# EAGLE design remote_sch (EAGLE 9.6.2)
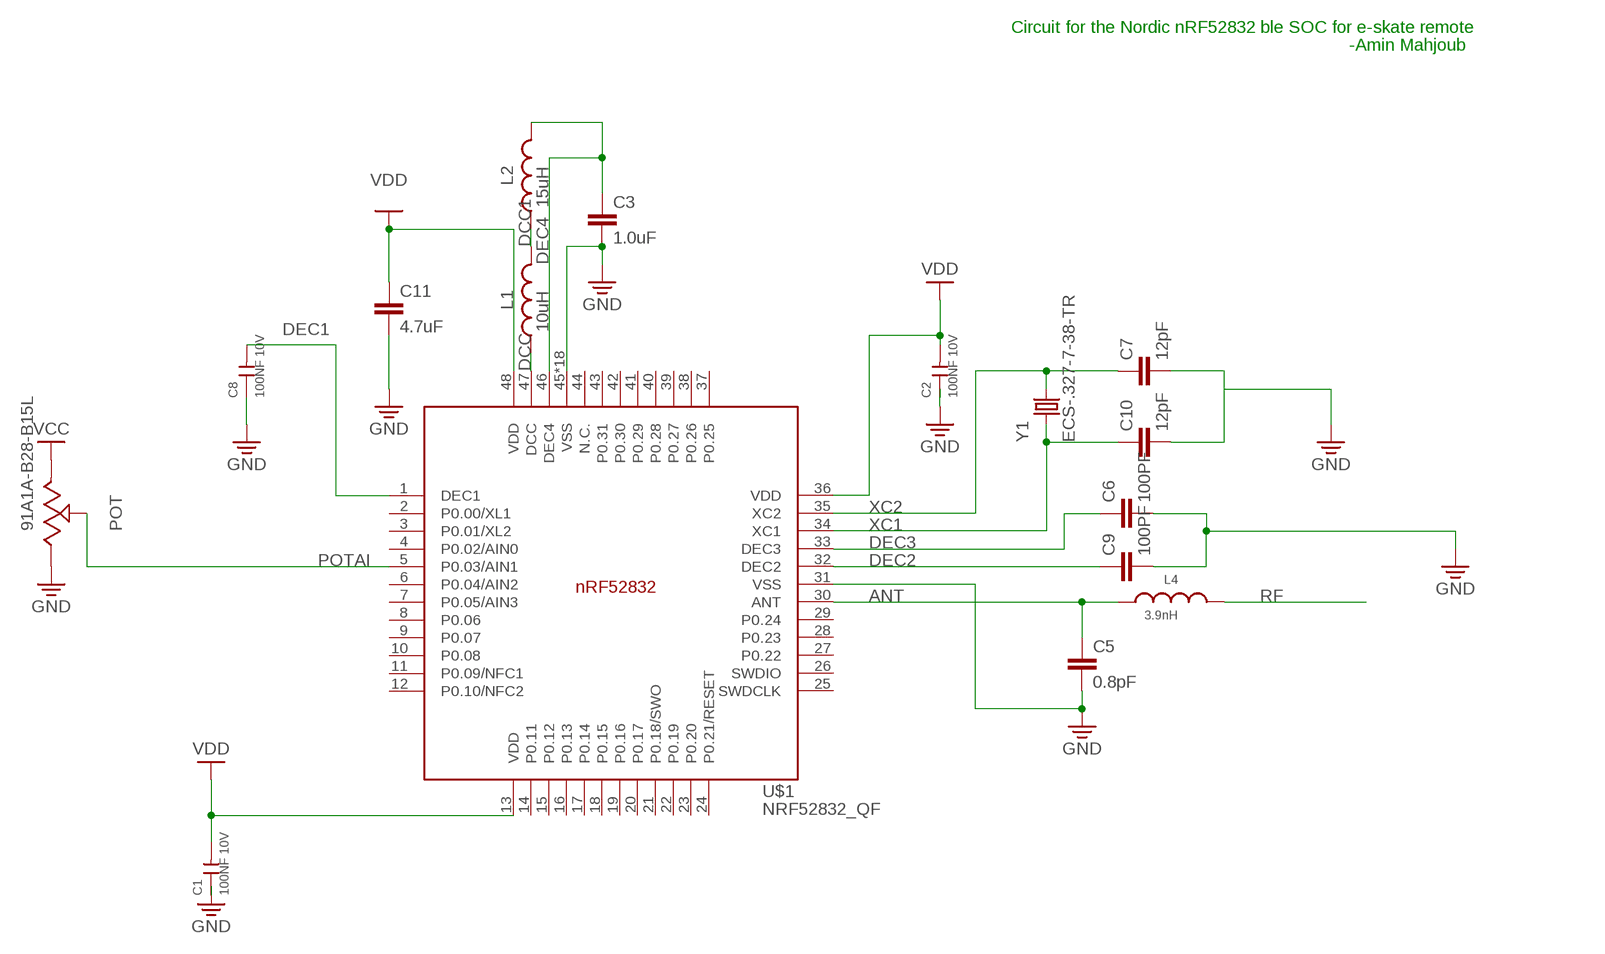
[diagram p0: schematic, sheet 1]

## Parts
C1  100NF 10V  CERAMIC 100NF-10V-10%-X5R(0402)  [C0402]
C2  100NF 10V  CERAMIC 100NF-10V-10%-X5R(0402)  [C0402]
C3  1.0uF  1.0UF-0402-16V-10%  [0402]
C5  0.8pF  0.8PF-0402-50V-0.1PF  [0402]
C6  100PF  100PF-0402-50V-5%  [0402]
C7  12pF  12PF-0603-50V-5%  [0603]
C8  100NF 10V  CERAMIC 100NF-10V-10%-X5R(0402)  [C0402]
C9  100PF  100PF-0402-50V-5%  [0402]
C10  12pF  12PF-0603-50V-5%  [0603]
C11  4.7uF  4.7UF-0402_TIGHT-6.3V-20%-X5R  [0402-TIGHT]
L1  10uH  WE-MAIA_2510_78438323100  [WE-MAIA_2510]
L2  15uH  WE-MAIA_3015_78438335150  [WE-MAIA_3015]
L4  3.9nH  WE-MK_0201_7447820039  [WE-MK_0201]
POT  91A1A-B28-B15L  [91A1A-B28-B15L-ND]
U$1  NRF52832_QF  [QFN40P600X600X90-48_N]
Y1  ECS-.327-7-38-TR  [ECS-.327-7-38-TR]

## Nets
ANT: C5.1 L4.1 U$1.30(ANT)
DCC: L1.1 U$1.47(DCC)
DCC1: L1.2 L2.1
DEC1: C8.2 U$1.1(DEC1)
DEC2: C9.1 U$1.32(DEC2)
DEC3: C6.1 U$1.33(DEC3)
DEC4: C3.1 L2.2 U$1.46(DEC4)
GND: C1.1 C2.1 C3.2 C5.2 C6.2 C7.2 C8.1 C9.2 C10.2 C11.2 POT.3 U$1.31(VSS) U$1.45(VSS) U$1.PAD(VSS) U$1.PAD@VIA01(VSS) U$1.PAD@VIA02(VSS) U$1.PAD@VIA03(VSS) U$1.PAD@VIA04(VSS) U$1.PAD@VIA05(VSS) U$1.PAD@VIA06(VSS) U$1.PAD@VIA07(VSS) U$1.PAD@VIA08(VSS) U$1.PAD@VIA09(VSS) U$1.PAD@VIA10(VSS) U$1.PAD@VIA11(VSS) U$1.PAD@VIA12(VSS) U$1.PAD@VIA13(VSS) U$1.PAD@VIA14(VSS) U$1.PAD@VIA15(VSS) U$1.PAD@VIA16(VSS)
POTAI: POT.2 U$1.5(P0.03/AIN1)
RF: L4.2
VCC: POT.1
VDD: C1.2 C2.2 C11.1 U$1.13(VDD) U$1.36(VDD) U$1.48(VDD)
XC1: C10.1 U$1.34(XC1) Y1.1
XC2: C7.1 U$1.35(XC2) Y1.4
Unconnected: U$1.2(P0.00/XL1) U$1.3(P0.01/XL2) U$1.4(P0.02/AIN0) U$1.6(P0.04/AIN2) U$1.7(P0.05/AIN3) U$1.8(P0.06) U$1.9(P0.07) U$1.10(P0.08) U$1.11(P0.09/NFC1) U$1.12(P0.10/NFC2) U$1.14(P0.11) U$1.15(P0.12) U$1.16(P0.13) U$1.17(P0.14) U$1.18(P0.15) U$1.19(P0.16) U$1.20(P0.17) U$1.21(P0.18/SWO) U$1.22(P0.19) U$1.23(P0.20) U$1.24(P0.21/RESET) U$1.25(SWDCLK) U$1.26(SWDIO) U$1.27(P0.22) U$1.28(P0.23) U$1.29(P0.24) U$1.37(P0.25) U$1.38(P0.26) U$1.39(P0.27) U$1.40(P0.28) U$1.41(P0.29) U$1.42(P0.30) U$1.43(P0.31) U$1.44(N.C.)

## Notes on the sheet
- Circuit for the Nordic nRF52832 ble SOC for e-skate remote
- -Amin Mahjoub

## Library data of the parts
C1 C2 C8 = OPL_Capacitor:CERAMIC 100NF-10V-10%-X5R(0402): 302010037; MPN: CC0402KRX5R6BB104
C3 = SparkFun-Capacitors:1.0UF: 1µF ceramic capacitors A capacitor is a passive two-terminal electrical component used to store electrical energy temporarily in an electric field.; PROD_ID: CAP-12417
C5 = SparkFun-Capacitors:0.8PF: 0.8pF ceramic capacitors A capacitor is a passive two-terminal electrical component used to store electrical energy temporarily in an electric field.; PROD_ID: CAP-13456
C6 C9 = SparkFun-Capacitors:100PF: 100pF/0.1nF ceramic capacitors A capacitor is a passive two-terminal electrical component used to store electrical energy temporarily in an electric field.; PROD_ID: CAP-13458
C7 C10 = SparkFun-Capacitors:12PF: 12pF ceramic capacitors A capacitor is a passive two-terminal electrical component used to store electrical energy temporarily in an electric field.; PROD_ID: CAP-09137
C11 = SparkFun-Capacitors:4.7UF: 4.7µF ceramic capacitors A capacitor is a passive two-terminal electrical component used to store electrical energy temporarily in an electric field.; PROD_ID: CAP-14240
L1 = Wurth_Automotive_WE-MAIA:WE-MAIA_2510: WE-MAIA SMD Power Inductor Characteristics Magnetic iron alloy allows high rated currents Compact design Magnetically shielded Hight current capability and handles hight transient current spikes No acoustic noise and no leakage flux noise Operating temperature range: -40°C up to +125°C Applications Power supplies for mobile devices DC/DC-converter for high current power supplies DC/DC-converter for Field Programmable Gate Array (FPGA) POL-converters Microcontroller Portable as well as battery-driven devices Wireless communication devices <https://katalog.we-online.de/media/images/v2/o56285v209%20Family_WE-MAIA.jpg> Details see: https://katalog.we-online.de/en/am/WE-MAIA Updated By Ella Wu 2019-09-10 2019 (C) Wurth Elektronik; DATASHEET-URL: https://katalog.we-online.de/am/datasheet/78438323100.pdf; FRES: 25MHz; IR: 0.6A; ISAT: 1.35A; MOUNT: SMT; PART-NUMBER: 78438323100; RDC: 843mOhm
L2 = Wurth_Automotive_WE-MAIA:WE-MAIA_3015: WE-MAIA SMD Power Inductor Characteristics Magnetic iron alloy allows high rated currents Compact design Magnetically shielded Hight current capability and handles hight transient current spikes No acoustic noise and no leakage flux noise Operating temperature range: -40°C up to +125°C Applications Power supplies for mobile devices DC/DC-converter for high current power supplies DC/DC-converter for Field Programmable Gate Array (FPGA) POL-converters Microcontroller Portable as well as battery-driven devices Wireless communication devices <https://katalog.we-online.de/media/images/v2/o56285v209%20Family_WE-MAIA.jpg> Details see: https://katalog.we-online.de/en/am/WE-MAIA Updated By Ella Wu 2019-09-10 2019 (C) Wurth Elektronik; DATASHEET-URL: https://katalog.we-online.de/am/datasheet/78438335150.pdf; FRES: 14MHz; IR: 0.65A; ISAT: 1.71A; MOUNT: SMT; PART-NUMBER: 78438335150; RDC: 830mOhm
L4 = Wurth_Signal & Communications_WE-MK:WE-MK_0201: WE-MK Multilayer Ceramic SMT Inductor Characteristics Windings printed on ceramic substrate Extremely high self resonant frequency > 17 GHz Inductive tolerances of 5%; ± 0.3 nH Operating temperature: –40°C to +120°C Inductance is stable over temperature Recommended solder profile: Reflow/wave Applications High frequency circuits Bluetooth Wireless LAN Filter circuits Oscillators Pagers Laptops PCMCIA-cards <https://www.we-online.com/catalog/media/o175867v209%20Gruppe_WE-MK_0402A_0201_0603.jpg> Details see: https://www.we-online.com/catalog/en/WE-MK/ Updated by Ella Wu 2020-10-29 2020 (C) Wurth Elektronik; DATASHEET-URL: https://www.we-online.de/katalog/datasheet/7447820039.pdf; FRES: 6000MHz; IR: 300mA; MOUNT: SMT; PART-NUMBER: 7447820039; Q-FACTOR: 4; RDC: 0.27Ohm
POT = Potentiometer_Trimmers:91A1A-B28-B15L: POT 10K OHM 1W PLASTIC LINEAR Manufacturer's datasheet <https://www.bourns.com/docs/Product-Datasheets/91_95.pdf>; CREATED_BY: PCBLayout.com; DIGIKEY_PARTNO: 91A1A-B28-B15L-ND; MANUFACTURER: Bourns Inc.; MPN: 91A1A-B28-B15L
U$1 = Nordic_nRF:NRF52832_QF: nRF52832 Features Single chip, highly flexible, 2.4 GHz multi-protocol SoC 32-bit ARM Cortex-M4F Processor 1.7v to 3.6v operation 512kB flash + 64kB RAM Supports concurrent Bluetooth Smart/ANT protocol operation On-chip NFC tag for Out-of-Band (OOB) pairing Up to +4dBm output power -96dBm sensitivity, Bluetooth Smart Thread safe and run-time protected Event driven API On air compatible with nRF24L and nRF24AP series 2 data rates (2Mbps/1Mbps) PPI - maximum flexibility for power-efficient applications and code simplification Automated power management system with automatic power management of each peripheral Configurable I/O mapping for analog and digital I/O 3 x Master/Slave SPI 2 x Two-wire interface (I²C) UART (RTS/CTS) 3 x PWM AES HW encryption Real Time Counter (RTC) Digital microphone interface (PDM) On-chip balun Applications Internet of Things (IoT) Wearables SmartHome sensors Connected white goods Computer peripherals Voice-command smart remotes A4WP ‘Rezence’ wireless charging Beacons Sports and fitness sensors and hubs Connected health products Smart watches RC Toys Interactive games Building automation and sensor networks
Y1 = Crystals_Oscillators:ECS-.327-7-38-TR: CRYSTAL 32.7680KHZ 7PF SMD Manufacturer's datasheet <https://ecsxtal.com/store/pdf/ecx-71.pdf>; CREATED_BY: PCBLayout.com; DIGIKEY_PART_NUMBER: XC1657TR-ND; MANUFACTURER: ECS Inc.; MPN: ECS-.327-7-38-TR; PACKAGE: 4-SMD

## Board
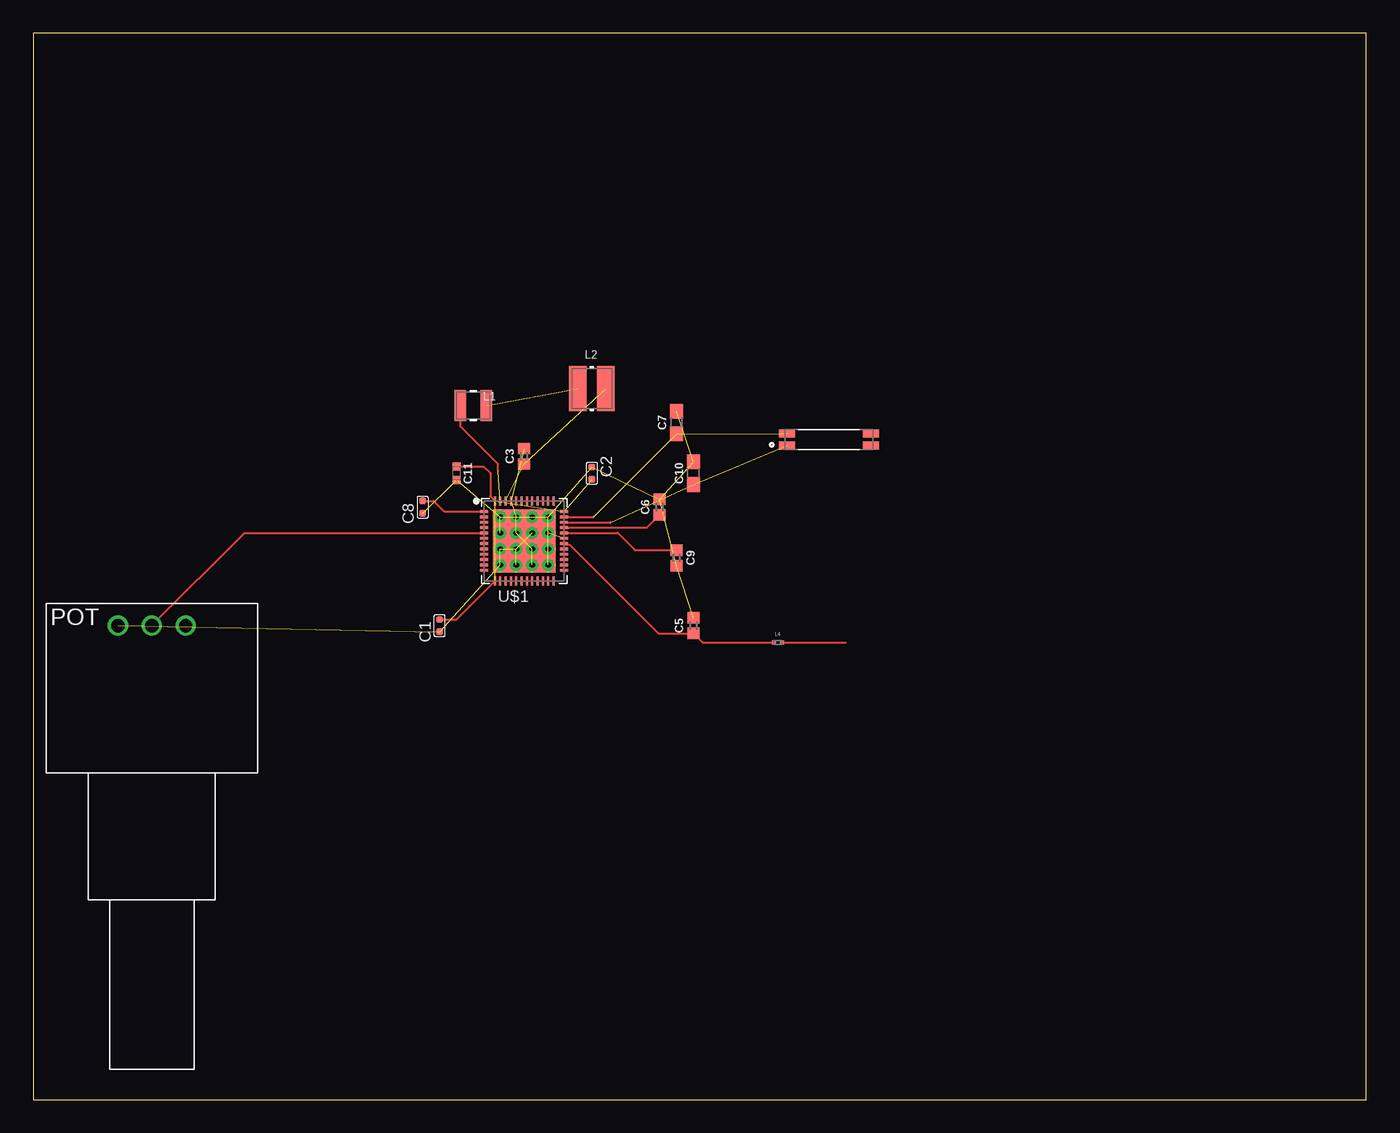
[diagram p1: board, top side]

Size 100 x 80 mm. Coordinates in mm from the lower left corner, seen from the top.
Outline: 0,0 100,0 100,80 0,80 0,0
Copper layers (1*16): Top 0.035mm / dielectric 1.5mm / Bottom 0.035mm
Design rules "default": minimum track width 6mil, minimum drill 0.35mm, track to track 6mil, track to pad 6mil, pad to pad 6mil, via to via 6mil, smd to smd 6mil, copper to edge 40mil, drill to drill 6mil, minimum pad ring 10mil, minimum via ring 8mil, stop-mask expansion 4mil, vias tented up to drill 0mil, thermal gap 10mil

### Footprints (pad centres in the part's own frame; a part is rotated, then mirrored left to right if it is on the bottom)
C0402 = smd 0.5 x 0.5: 1 0,0.463; 2 0,-0.463
0402 = smd 0.85 x 0.9: 1 -0.58,0; 2 0.58,0
0603 = smd 1.1 x 1: 1 -0.85,0; 2 0.85,0
0402-TIGHT = smd 0.6 x 0.6: 1 -0.5,0; 2 0.5,0
WE-MAIA_2510 = smd 0.85 x 2.3: 1 -0.975,0; 2 0.975,0
WE-MAIA_3015 = smd 1.3 x 3.4: 1 -1.05,0; 2 1.05,0
WE-MK_0201 = smd 0.3 x 0.3: 1 -0.3,0; 2 0.3,0
91A1A-B28-B15L-ND = drill 1: 1 2.54,0; 2 0,0; 3 -2.54,0
QFN40P600X600X90-48_N = smd 0.65 x 0.2: 1 -3,2.2; 2 -3,1.8; 3 -3,1.4; 4 -3,1; 5 -3,0.6; 6 -3,0.2; 7 -3,-0.2; 8 -3,-0.6; 9 -3,-1; 10 -3,-1.4; 11 -3,-1.8; 12 -3,-2.2; 25 3,-2.2; 26 3,-1.8; 27 3,-1.4; 28 3,-1; 29 3,-0.6; 30 3,-0.2; 31 3,0.2; 32 3,0.6; 33 3,1; 34 3,1.4; 35 3,1.8; 36 3,2.2 | smd 0.2 x 0.65: 13 -2.2,-3; 14 -1.8,-3; 15 -1.4,-3; 16 -1,-3; 17 -0.6,-3; 18 -0.2,-3; 19 0.2,-3; 20 0.6,-3; 21 1,-3; 22 1.4,-3; 23 1.8,-3; 24 2.2,-3; 37 2.2,3; 38 1.8,3; 39 1.4,3; 40 1,3; 41 0.6,3; 42 0.2,3; 43 -0.2,3; 44 -0.6,3; 45 -1,3; 46 -1.4,3; 47 -1.8,3; 48 -2.2,3 | smd 4.7 x 4.7: PAD 0,0 | drill 0.4: PAD@VIA01 -1.8,1.8; PAD@VIA02 -1.8,0.6; PAD@VIA03 -1.8,-0.6; PAD@VIA04 -1.8,-1.8; PAD@VIA05 -0.6,1.8; PAD@VIA06 -0.6,0.6; PAD@VIA07 -0.6,-0.6; PAD@VIA08 -0.6,-1.8; PAD@VIA09 0.6,1.8; PAD@VIA10 0.6,0.6; PAD@VIA11 0.6,-0.6; PAD@VIA12 0.6,-1.8; PAD@VIA13 1.8,1.8; PAD@VIA14 1.8,0.6; PAD@VIA15 1.8,-0.6; PAD@VIA16 1.8,-1.8
ECS-.327-7-38-TR = smd 1.2 x 0.6: 1 -3.15,-0.45; 2 3.15,-0.45; 3 3.15,0.45; 4 -3.15,0.45

### Placement (x,y rotation side)
C1  30.48,35.56 180 top
C2  41.91,46.99 0 top
C3  36.83,48.26 90 top
C5  49.53,35.56 90 top
C6  46.99,44.45 90 top
C7  48.26,50.8 90 top
C8  29.21,44.45 180 top
C9  48.26,40.64 270 top
C10  49.53,46.99 90 top
C11  31.75,46.99 270 top
L1  33.02,52.07 0 top
L2  41.91,53.34 0 top
L4  55.88,34.29 0 top
POT  8.89,35.56 0 top
U$1  36.83,41.91 0 top
Y1  59.69,49.53 0 top

### Tracks (layer width: path | path; a pad name or v marks a point on that pad's centre or on a via)
ANT
  Top 0.152: U$1.30 39.9,41.64 40.23,41.64 46.89,34.98 C5.1 50.22,34.29 L4.1
DCC  (1 unrouted)
  Top 0.152: L1.1 32.05,50.51 34.88,47.67 34.88,47.16
DCC1  (1 unrouted)
DEC1
  Top 0.152: C8.2 30.02,44.91 30.82,44.11 U$1.1
DEC2
  Top 0.152: U$1.32 43.85,42.51 45.14,41.22 C9.1
DEC3
  Top 0.152: U$1.33 46.03,42.91 C6.1
DEC4  (2 unrouted)
GND  (29 unrouted)
POTAI
  Top 0.152: POT.2 15.84,42.51 U$1.5
RF
  Top 0.152: L4.2 60.96,34.29
VDD  (3 unrouted)
  Top 0.152: C11.1 33.79,47.49 34.29,46.99 34.29,45.25 U$1.48 | C1.2 31.74,36.02 U$1.13
XC1  (2 unrouted)
  Top 0.152: U$1.34 43.31,43.31
XC2  (2 unrouted)
  Top 0.152: U$1.35 42.02,43.71